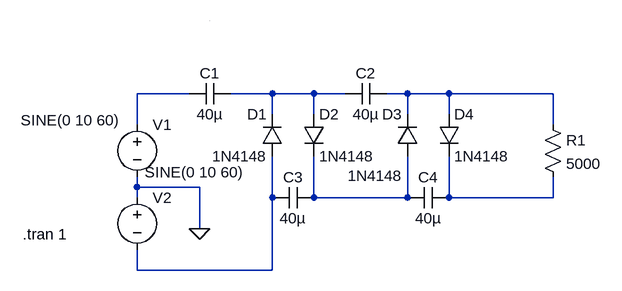
[diagram p0: schematic voltage_multiplier_t1.asc]
voltage_multiplier_t1.asc, the LTspice schematic file:
Version 4
SHEET 1 1108 680
WIRE -32 112 -112 112
WIRE 96 112 32 112
WIRE 160 112 96 112
WIRE 208 112 160 112
WIRE 304 112 272 112
WIRE 368 112 304 112
WIRE 528 112 368 112
WIRE 96 144 96 112
WIRE 160 144 160 112
WIRE 304 144 304 112
WIRE 368 144 368 112
WIRE -112 160 -112 112
WIRE 528 160 528 112
WIRE -112 256 -112 240
WIRE -16 256 -112 256
WIRE -112 272 -112 256
WIRE 96 272 96 208
WIRE 160 272 160 208
WIRE 304 272 304 208
WIRE 304 272 160 272
WIRE 368 272 368 208
WIRE 528 272 528 240
WIRE 528 272 368 272
WIRE -16 320 -16 256
WIRE -112 384 -112 352
WIRE 96 384 96 272
WIRE 96 384 -112 384
WIRE 0 0 0 0
FLAG -16 320 0
SYMBOL diode 112 208 R180
WINDOW 0 24 64 Left 2
WINDOW 3 24 0 Left 2
SYMATTR InstName D1
SYMATTR Value 1N4148
SYMBOL diode 144 144 R0
SYMATTR InstName D2
SYMATTR Value 1N4148
SYMBOL diode 320 208 R180
WINDOW 0 24 64 Left 2
WINDOW 3 23 -30 Left 2
SYMATTR InstName D3
SYMATTR Value 1N4148
SYMBOL diode 352 144 R0
SYMATTR InstName D4
SYMATTR Value 1N4148
SYMBOL cap 32 96 R90
WINDOW 0 0 32 VBottom 2
WINDOW 3 32 32 VTop 2
SYMATTR InstName C1
SYMATTR Value 40µ
SYMBOL cap 272 96 R90
WINDOW 0 0 32 VBottom 2
WINDOW 3 32 32 VTop 2
SYMATTR InstName C2
SYMATTR Value 40µ
SYMBOL cap 160 256 R90
WINDOW 0 0 32 VBottom 2
WINDOW 3 32 32 VTop 2
SYMATTR InstName C3
SYMATTR Value 40µ
SYMBOL cap 368 256 R90
WINDOW 0 0 32 VBottom 2
WINDOW 3 32 32 VTop 2
SYMATTR InstName C4
SYMATTR Value 40µ
SYMBOL voltage -112 144 R0
WINDOW 3 -179 9 Left 2
WINDOW 123 0 0 Left 0
WINDOW 39 0 0 Left 0
SYMATTR Value SINE(0 10 60)
SYMATTR InstName V1
SYMBOL res 512 144 R0
SYMATTR InstName R1
SYMATTR Value 5000
SYMBOL voltage -112 256 R0
WINDOW 3 12 -23 Left 2
WINDOW 123 0 0 Left 0
WINDOW 39 0 0 Left 0
SYMATTR Value SINE(0 10 60)
SYMATTR InstName V2
TEXT -288 328 Left 2 !.tran 1

The netlist it stands for:
* voltage_multiplier_t1.asc
D1 N004 N002 1N4148
D2 N002 N005 1N4148
D3 N005 N003 1N4148
D4 N003 N006 1N4148
C1 N002 N001 40µ
C2 N003 N002 40µ
C3 N005 N004 40µ
C4 N006 N005 40µ
V1 N001 0 SINE(0 10 60)
R1 N003 N006 5000
V2 0 N004 SINE(0 10 60)
.model D D
.lib standard.dio
.tran 1
.backanno
.end